# EAGLE design ncp1117 (EAGLE 7.1.0)
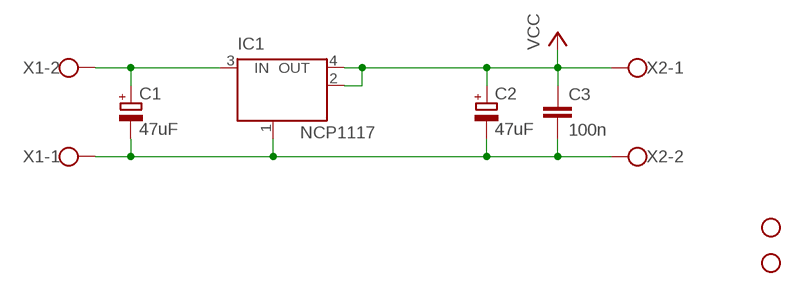
[diagram p0: schematic, sheet 1]

## Parts
C1  47uF  CPOL-EUE2.5-5  [E2,5-5]
C2  47uF  CPOL-EUE2.5-5  [E2,5-5]
C3  100n  C-EUC1206K  [C1206K]
IC1  NCP1117  MC33269ST-3.3T3  [SOT223]
STANDOFF1  STAND-OFF  [STAND-OFF]
STANDOFF2  STAND-OFF  [STAND-OFF]
X1  W237-102  [W237-102]
X2  W237-102  [W237-102]

## Nets
N$2: C1.+ IC1.3(IN) X1.2
N$4: C1.- C2.- C3.2 IC1.1(GND/ADJ) X1.1 X2.2
VCC: C2.+ C3.1 IC1.2(OUT) IC1.4(OUT) X2.1

## Library data of the parts
C1 C2 = rcl:CPOL-EU: POLARIZED CAPACITOR, European symbol
C3 = rcl:C-EU: CAPACITOR, European symbol
IC1 = linear:MC33269ST*: Adjustable Output Low Dropout Voltage Regulator 800 mA Source: http://www.onsemi.com/pub/Collateral/MC33269-D.PDF
STANDOFF1 STANDOFF2 = SparkFun-Electromechanical:STAND-OFF: #4 Stand Off This is the mechanical footprint for a #4 phillips button head screw. Use the keepout ring to avoid running the screw head into surrounding components. SKU : PRT-00447
X1 X2 = con-wago-500:W237-102: WAGO SCREW CLAMP; MPN: 237-102; OC_FARNELL: unknown; OC_NEWARK: 70K9898

## Board
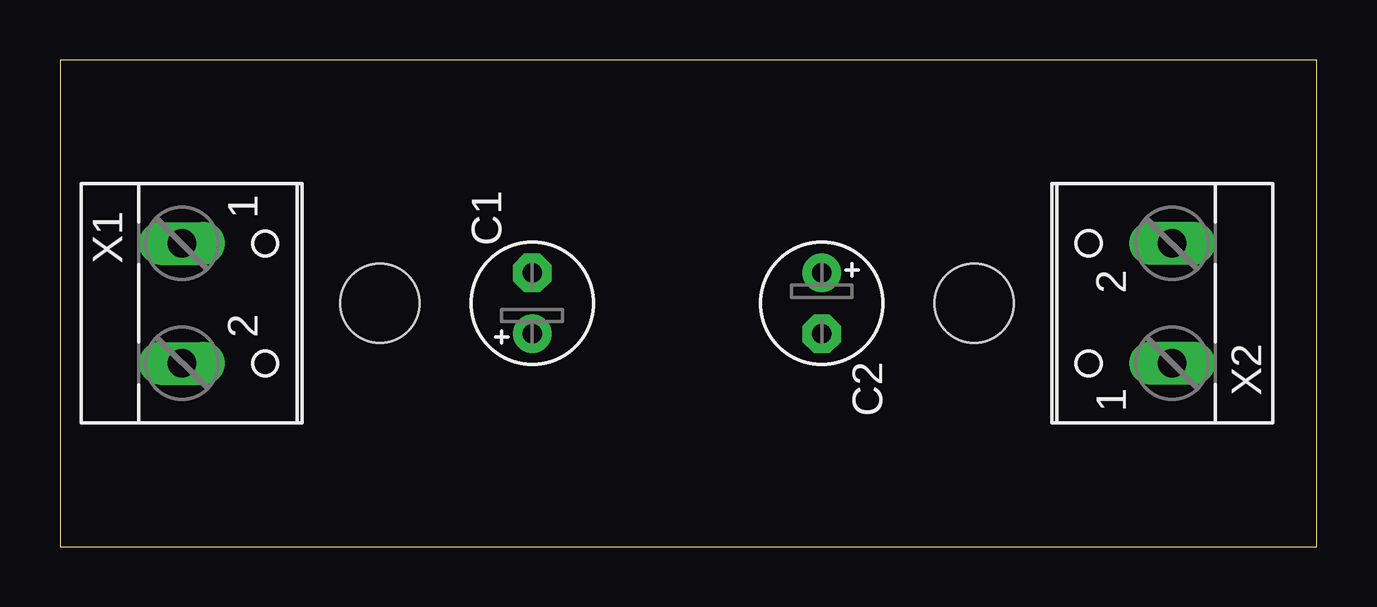
[diagram p1: board, top side]
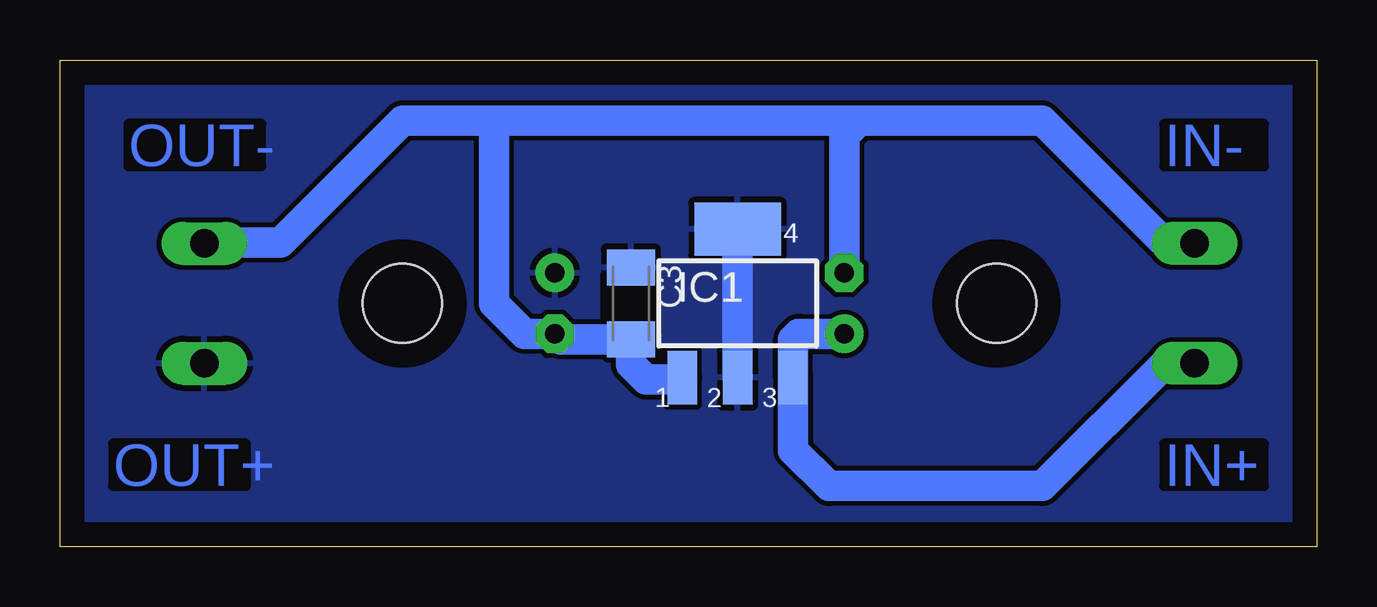
[diagram p2: board, bottom side, seen from below]

Size 52.38 x 20.31 mm. Coordinates in mm from the lower left corner, seen from the top.
Outline: 0,0 52.38,0 52.38,20.31 0,20.31 0,0
Copper layers (1*16): Top 0.035mm / dielectric 1.5mm / Bottom 0.035mm
Design rules "default": minimum track width 10mil, minimum drill 24mil, track to track 8mil, track to pad 8mil, pad to pad 8mil, via to via 8mil, smd to smd 8mil, copper to edge 40mil, drill to drill 8mil, minimum pad ring 10mil, minimum via ring 8mil, stop-mask expansion 4mil, vias tented up to drill 0mil, thermal gap 10mil
bRestrict: area 27.3,8.9 to 29.8,11.4

### Footprints (pad centres in the part's own frame; a part is rotated, then mirrored left to right if it is on the bottom)
E2,5-5 = drill 0.813 pad 1.6: + -1.27,0 | drill 0.813 pad 1.6 octagon: - 1.27,0
C1206K = smd 1.5 x 2: 1 -1.5,0; 2 1.5,0
SOT223 = smd 1.219 x 2.235: 1 -2.311,-3.099; 2 0,-3.099; 3 2.311,-3.099 | smd 3.6 x 2.2: 4 0,3.099
STAND-OFF = hole 3.302: 0,0
W237-102 = drill 1.194 long: 1 -2.5,-1.27; 2 2.5,-1.27

### Placement (x,y rotation side)
C1  19.69,10.16 90 top
C2  31.75,10.16 270 top
C3  28.57,10.16 270 bottom
IC1  24.13,10.16 0 bottom
STANDOFF1  38.1,10.16 0 top
STANDOFF2  13.34,10.16 0 top
X1  6.35,10.16 270 top
X2  45.09,10.16 90 top

### Tracks (layer width: path | path; a pad name or v marks a point on that pad's centre or on a via)
N$2
  Bottom 1.27: X1.2 6.31,7.66 11.43,2.54 20.32,2.54 21.82,4.04 IC1.3 21.82,8.66 21.59,8.89 C1.+
N$4
  Bottom 1.27: X1.1 6.31,12.66 11.43,17.78 19.05,17.78 | 19.05,17.78 34.29,17.78 | 34.29,17.78 38.1,17.78 43.18,12.7 46.31,12.7 X2.2 | C1.- 19.69,17.14 19.05,17.78 | IC1.1 26.52,6.98 27.94,6.98 28.57,7.62 C3.2 31.52,8.66 C2.- 33.02,8.89 34.29,10.16 34.29,17.78
VCC
  Bottom 1.27: IC1.4 IC1.2
  pour Bottom: -1.27,21.59 53.34,21.59 53.34,-1.27 -1.27,-1.27

### Text on the board
Bottom: IN- | OUT- | IN+ | OUT+